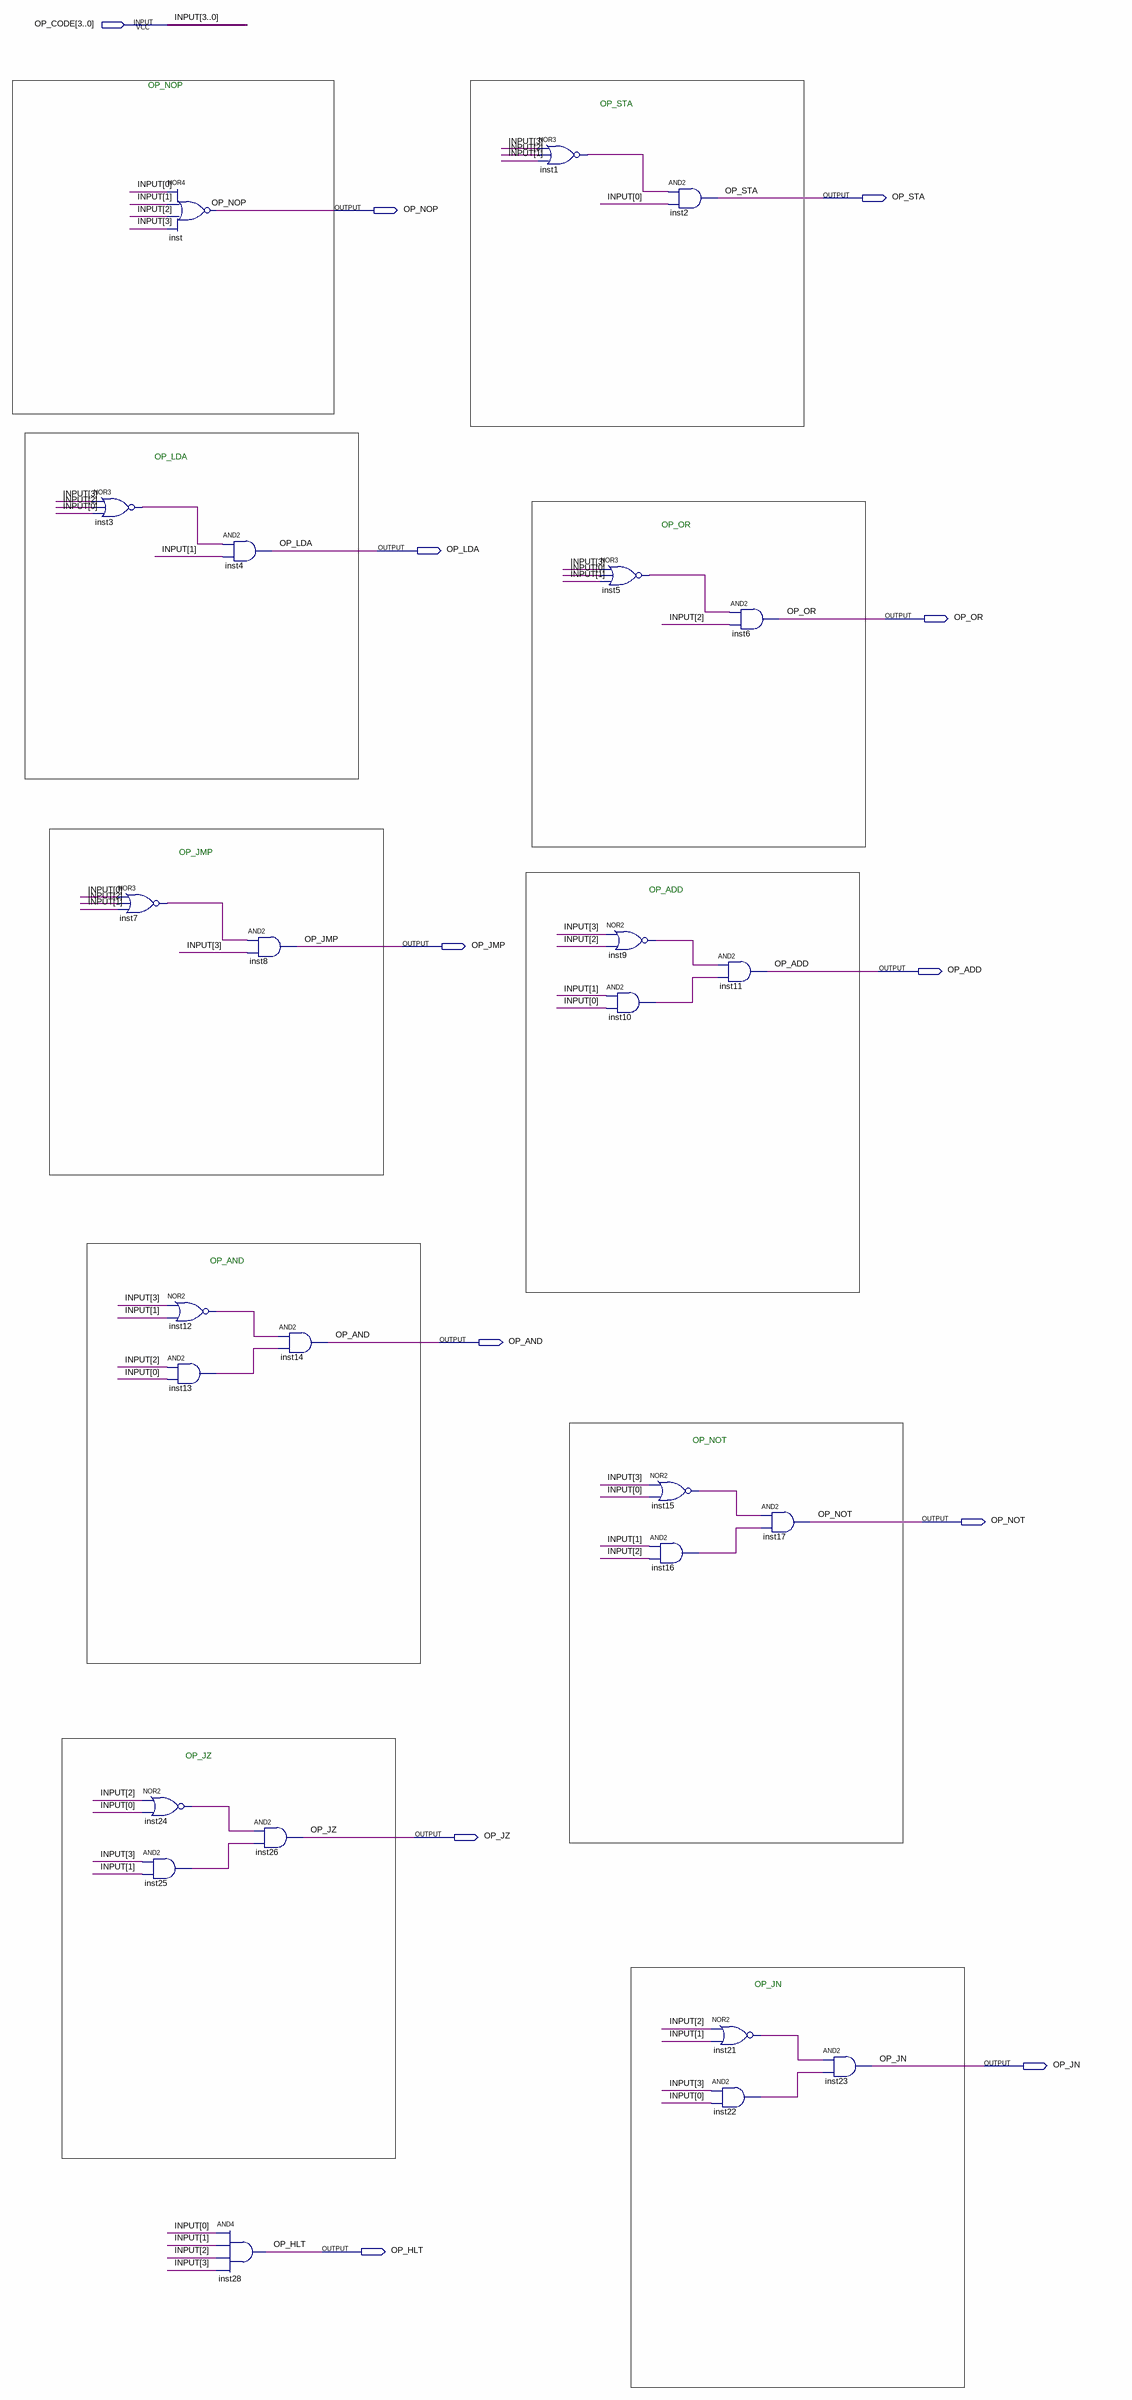
[diagram p0: schematic sheet]
// Quartus schematic OP_DECODER.bdf as structural Verilog: 25 symbols, 12 pins
module OP_DECODER (
  input  [3:0] OP_CODE,
  output OP_STA,
  output OP_NOP,
  output OP_LDA,
  output OP_OR,
  output OP_JMP,
  output OP_ADD,
  output OP_AND,
  output OP_NOT,
  output OP_JZ,
  output OP_JN,
  output OP_HLT
);

  wire inst1_out, inst3_out, inst5_out, inst7_out, inst9_out, inst10_out, inst12_out, inst13_out, inst15_out,
       inst16_out, inst21_out, inst22_out, inst24_out, inst25_out;

  nor inst3 (inst3_out, OP_CODE[3], OP_CODE[2], OP_CODE[0]);
  nor inst7 (inst7_out, OP_CODE[0], OP_CODE[2], OP_CODE[1]);
  nor inst24 (inst24_out, OP_CODE[2], OP_CODE[0]);
  and inst25 (inst25_out, OP_CODE[3], OP_CODE[1]);
  nor inst (OP_NOP, OP_CODE[0], OP_CODE[1], OP_CODE[2], OP_CODE[3]);
  nor inst12 (inst12_out, OP_CODE[3], OP_CODE[1]);
  and inst13 (inst13_out, OP_CODE[2], OP_CODE[0]);
  and inst4 (OP_LDA, inst3_out, OP_CODE[1]);
  and inst28 (OP_HLT, OP_CODE[0], OP_CODE[1], OP_CODE[2], OP_CODE[3]);
  and inst8 (OP_JMP, inst7_out, OP_CODE[3]);
  and inst14 (OP_AND, inst12_out, inst13_out);
  and inst26 (OP_JZ, inst24_out, inst25_out);
  nor inst1 (inst1_out, OP_CODE[3], OP_CODE[2], OP_CODE[1]);
  nor inst5 (inst5_out, OP_CODE[3], OP_CODE[0], OP_CODE[1]);
  nor inst9 (inst9_out, OP_CODE[3], OP_CODE[2]);
  and inst10 (inst10_out, OP_CODE[1], OP_CODE[0]);
  and inst2 (OP_STA, inst1_out, OP_CODE[0]);
  nor inst15 (inst15_out, OP_CODE[3], OP_CODE[0]);
  and inst16 (inst16_out, OP_CODE[1], OP_CODE[2]);
  and inst6 (OP_OR, inst5_out, OP_CODE[2]);
  and inst11 (OP_ADD, inst9_out, inst10_out);
  nor inst21 (inst21_out, OP_CODE[2], OP_CODE[1]);
  and inst22 (inst22_out, OP_CODE[3], OP_CODE[0]);
  and inst17 (OP_NOT, inst15_out, inst16_out);
  and inst23 (OP_JN, inst21_out, inst22_out);

  // Other names for the same wires on the sheet: INPUT[3:0] = OP_CODE

  // Notes on the sheet:
  //   OP_NOP
  //   OP_STA
  //   OP_LDA
  //   OP_OR
  //   OP_JMP
  //   OP_ADD
  //   OP_AND
  //   OP_NOT
  //   OP_JZ
  //   OP_JN
endmodule
